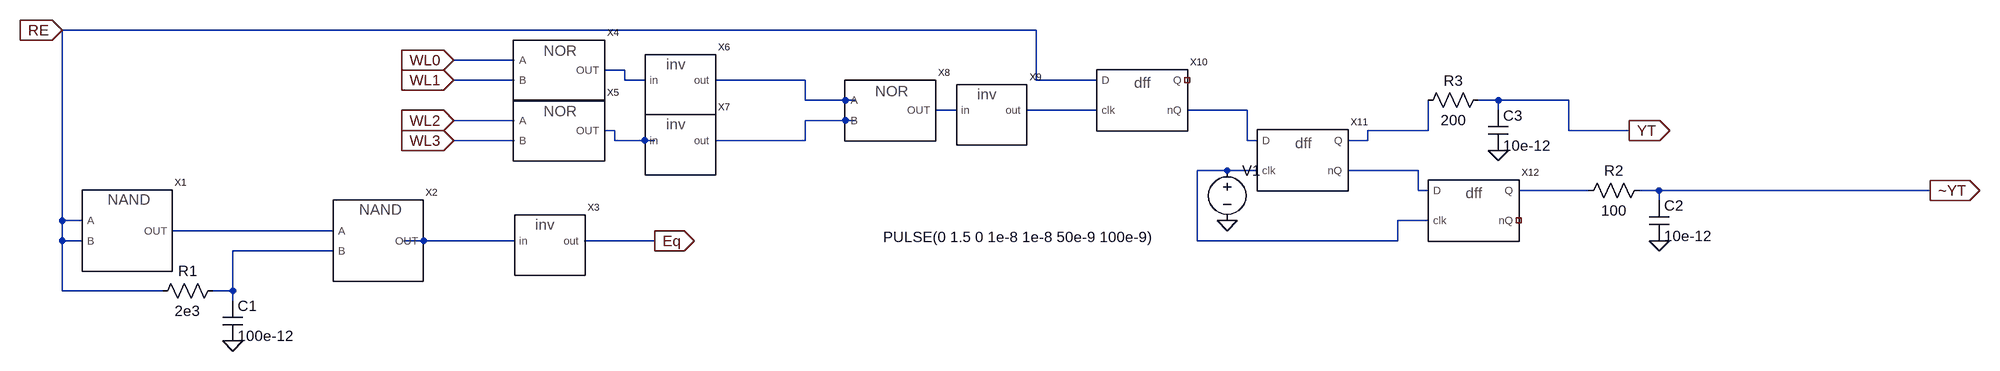
[diagram p0: schematic control_unit.asc]
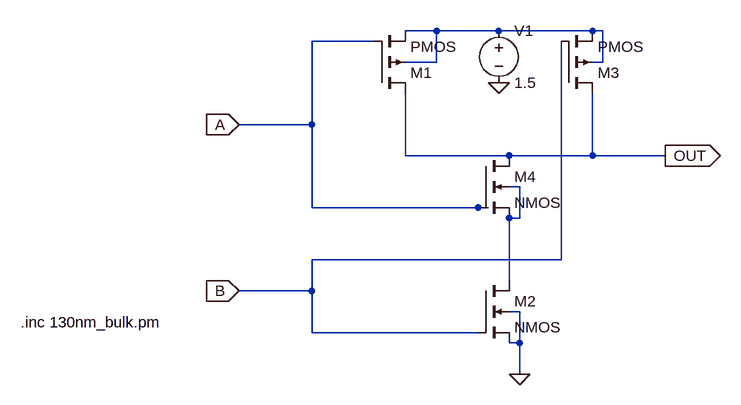
[diagram p1: sub-circuit nand.asc]
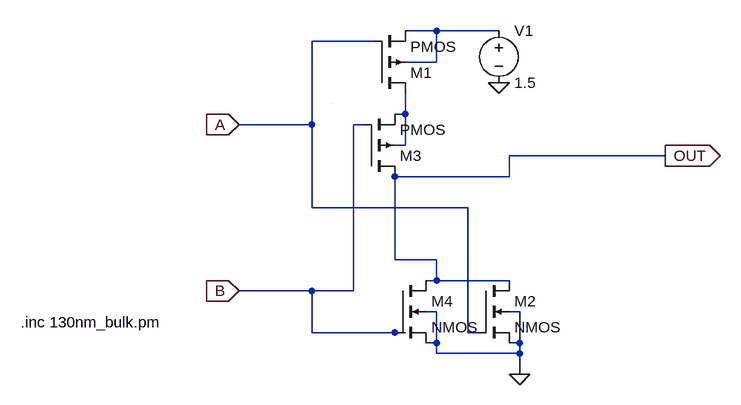
[diagram p2: sub-circuit nor.asc]
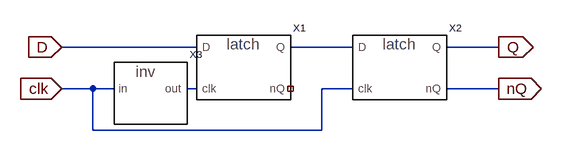
[diagram p3: sub-circuit dff.asc]
control_unit.asc, the LTspice schematic file:
Version 4
SHEET 1 2124 680
WIRE 592 -64 -960 -64
WIRE -240 -16 -336 -16
WIRE -64 0 -96 0
WIRE -240 16 -336 16
WIRE -64 16 -64 0
WIRE -32 16 -64 16
WIRE 224 16 80 16
WIRE 592 16 592 -64
WIRE 688 16 592 16
WIRE 224 48 224 16
WIRE 288 48 224 48
WIRE 304 48 288 48
WIRE 1328 48 1296 48
WIRE 1440 48 1328 48
WIRE 464 64 432 64
WIRE 688 64 576 64
WIRE 928 64 832 64
WIRE 1328 64 1328 48
WIRE -240 80 -336 80
WIRE 288 80 224 80
WIRE 304 80 288 80
WIRE -80 96 -96 96
WIRE 1216 96 1216 48
WIRE 1216 96 1120 96
WIRE 1440 96 1440 48
WIRE 1536 96 1440 96
WIRE -240 112 -336 112
WIRE -80 112 -80 96
WIRE -32 112 -80 112
WIRE -16 112 -32 112
WIRE 224 112 224 80
WIRE 224 112 80 112
WIRE 928 112 928 64
WIRE 944 112 928 112
WIRE 1120 112 1120 96
WIRE 1120 112 1088 112
WIRE 896 160 848 160
WIRE 944 160 896 160
WIRE 1200 160 1088 160
WIRE 1200 192 1200 160
WIRE 1216 192 1200 192
WIRE 1472 192 1360 192
WIRE 1584 192 1552 192
WIRE 2016 192 1584 192
WIRE 1584 208 1584 192
WIRE -960 240 -960 -64
WIRE -928 240 -960 240
WIRE 1216 240 1168 240
WIRE -528 256 -784 256
WIRE -960 272 -960 240
WIRE -928 272 -960 272
WIRE -384 272 -416 272
WIRE -240 272 -384 272
WIRE -16 272 -128 272
WIRE 848 272 848 160
WIRE 1168 272 1168 240
WIRE 1168 272 848 272
WIRE -528 288 -688 288
WIRE -960 352 -960 272
WIRE -800 352 -960 352
WIRE -688 352 -688 288
WIRE -688 352 -720 352
WIRE -688 368 -688 352
FLAG -688 432 0
FLAG -16 272 Eq
IOPIN -16 272 Out
FLAG -336 -16 WL0
IOPIN -336 -16 In
FLAG -336 16 WL1
IOPIN -336 16 In
FLAG -336 80 WL2
IOPIN -336 80 In
FLAG -336 112 WL3
IOPIN -336 112 In
FLAG 1536 96 YT
IOPIN 1536 96 Out
FLAG 896 240 0
FLAG 2016 192 ~YT
IOPIN 2016 192 Out
FLAG 1584 272 0
FLAG 1328 128 0
FLAG -960 -64 RE
IOPIN -960 -64 In
SYMBOL NAND -880 256 R0
SYMATTR InstName X1
SYMBOL NAND -480 272 R0
SYMATTR InstName X2
SYMBOL res -704 336 R90
WINDOW 0 0 56 VBottom 2
WINDOW 3 32 56 VTop 2
SYMATTR InstName R1
SYMATTR Value 2e3
SYMBOL cap -704 368 R0
SYMATTR InstName C1
SYMATTR Value 100e-12
SYMBOL invert -192 288 R0
SYMATTR InstName X3
SYMBOL NOR -176 -16 R0
SYMATTR InstName X4
SYMBOL NOR -176 80 R0
SYMATTR InstName X5
SYMBOL invert 16 32 R0
SYMATTR InstName X6
SYMBOL invert 16 128 R0
SYMATTR InstName X7
SYMBOL NOR 352 48 R0
SYMATTR InstName X8
SYMBOL invert 512 80 R0
SYMATTR InstName X9
SYMBOL DFF 768 48 R0
SYMATTR InstName X10
SYMBOL voltage 896 144 R0
WINDOW 3 -548 122 Left 2
WINDOW 123 0 0 Left 0
WINDOW 39 0 0 Left 0
SYMATTR Value PULSE(0 1.5 0 1e-8 1e-8 50e-9 100e-9)
SYMATTR InstName V1
SYMBOL dff 1024 144 R0
SYMATTR InstName X11
SYMBOL dff 1296 224 R0
SYMATTR InstName X12
SYMBOL res 1568 176 R90
WINDOW 0 0 56 VBottom 2
WINDOW 3 32 56 VTop 2
SYMATTR InstName R2
SYMATTR Value 100
SYMBOL cap 1568 208 R0
SYMATTR InstName C2
SYMATTR Value 10e-12
SYMBOL res 1312 32 R90
WINDOW 0 0 56 VBottom 2
WINDOW 3 32 56 VTop 2
SYMATTR InstName R3
SYMATTR Value 200
SYMBOL cap 1312 64 R0
SYMATTR InstName C3
SYMATTR Value 10e-12

nand.asc, the sub-circuit schematic file:
Version 4
SHEET 1 880 680
WIRE 304 -256 256 -256
WIRE 400 -256 304 -256
WIRE 544 -256 400 -256
WIRE 560 -256 544 -256
WIRE 208 -240 112 -240
WIRE 304 -208 304 -256
WIRE 304 -208 256 -208
WIRE 560 -208 560 -256
WIRE 560 -208 544 -208
WIRE 112 -112 112 -240
WIRE 112 -112 0 -112
WIRE 256 -64 256 -160
WIRE 416 -64 256 -64
WIRE 544 -64 544 -160
WIRE 544 -64 416 -64
WIRE 656 -64 544 -64
WIRE 432 -16 416 -16
WIRE 112 16 112 -112
WIRE 368 16 112 16
WIRE 384 16 368 16
WIRE 432 32 432 -16
WIRE 432 32 416 32
WIRE 496 96 496 -240
WIRE 496 96 112 96
WIRE 416 128 416 32
WIRE 112 144 112 96
WIRE 112 144 0 144
WIRE 432 176 416 176
WIRE 112 208 112 144
WIRE 368 208 112 208
WIRE 432 224 432 176
WIRE 432 224 416 224
WIRE 432 272 432 224
FLAG 432 272 0
FLAG 400 -176 0
FLAG 656 -64 OUT
IOPIN 656 -64 Out
FLAG 0 -112 A
IOPIN 0 -112 In
FLAG 0 144 B
IOPIN 0 144 In
SYMBOL pmos4 208 -160 M180
SYMATTR InstName M1
SYMATTR Value2 l=130e-9 w=2600e-9 ad=676000e-18 as=676000e-18 pd=3640e-9 ps=3640e-9
SYMBOL nmos4 368 128 R0
SYMATTR InstName M2
SYMATTR Value2 l=130e-9 w=1300e-9 ad=676000e-18 as=676000e-18 pd=3640e-9 ps=3640e-9
SYMBOL pmos4 496 -160 M180
SYMATTR InstName M3
SYMATTR Value2 l=130e-9 w=2600e-9 ad=676000e-18 as=676000e-18 pd=3640e-9 ps=3640e-9
SYMBOL nmos4 368 -64 R0
SYMATTR InstName M4
SYMATTR Value2 l=130e-9 w=1300e-9 ad=676000e-18 as=676000e-18 pd=3640e-9 ps=3640e-9
SYMBOL voltage 400 -272 R0
WINDOW 123 0 0 Left 0
WINDOW 39 0 0 Left 0
SYMATTR InstName V1
SYMATTR Value 1.5
TEXT -336 192 Left 2 !.inc 130nm_bulk.pm

nor.asc, the sub-circuit schematic file:
Version 4
SHEET 1 880 680
WIRE 160 -112 112 -112
WIRE 256 -112 160 -112
WIRE 64 -96 -32 -96
WIRE 160 -64 160 -112
WIRE 160 -64 112 -64
WIRE 112 16 112 -16
WIRE 112 16 96 16
WIRE -32 32 -32 -96
WIRE -32 32 -144 32
WIRE 48 32 32 32
WIRE 112 64 112 16
WIRE 112 64 96 64
WIRE 512 80 272 80
WIRE 272 112 272 80
WIRE 272 112 96 112
WIRE -32 160 -32 32
WIRE 208 160 -32 160
WIRE 96 240 96 112
WIRE 160 240 96 240
WIRE 160 272 160 240
WIRE 160 272 144 272
WIRE 272 272 160 272
WIRE -32 288 -144 288
WIRE 32 288 32 32
WIRE 32 288 -32 288
WIRE 160 320 144 320
WIRE 288 320 272 320
WIRE -32 352 -32 288
WIRE 96 352 -32 352
WIRE 112 352 96 352
WIRE 208 352 208 160
WIRE 224 352 208 352
WIRE 160 368 160 320
WIRE 160 368 144 368
WIRE 288 368 288 320
WIRE 288 368 272 368
WIRE 160 384 160 368
WIRE 288 384 288 368
WIRE 288 384 160 384
WIRE 288 416 288 384
WIRE 0 0 0 0
FLAG 288 416 0
FLAG 256 -32 0
FLAG 512 80 OUT
IOPIN 512 80 Out
FLAG -144 32 A
IOPIN -144 32 In
FLAG -144 288 B
IOPIN -144 288 In
SYMBOL pmos4 64 -16 M180
SYMATTR InstName M1
SYMATTR Value2 l=130e-9 w=2600e-9 ad=676000e-18 as=676000e-18 pd=3640e-9 ps=3640e-9
SYMBOL nmos4 224 272 R0
SYMATTR InstName M2
SYMATTR Value2 l=130e-9 w=1300e-9 ad=676000e-18 as=676000e-18 pd=3640e-9 ps=3640e-9
SYMBOL pmos4 48 112 M180
SYMATTR InstName M3
SYMATTR Value2 l=130e-9 w=2600e-9 ad=676000e-18 as=676000e-18 pd=3640e-9 ps=3640e-9
SYMBOL nmos4 96 272 R0
SYMATTR InstName M4
SYMATTR Value2 l=130e-9 w=1300e-9 ad=676000e-18 as=676000e-18 pd=3640e-9 ps=3640e-9
SYMBOL voltage 256 -128 R0
WINDOW 123 0 0 Left 0
WINDOW 39 0 0 Left 0
SYMATTR InstName V1
SYMATTR Value 1.5
TEXT -480 336 Left 2 !.inc 130nm_bulk.pm

dff.asc, the sub-circuit schematic file:
Version 4
SHEET 1 880 680
WIRE 64 112 -144 112
WIRE 304 112 208 112
WIRE 528 112 448 112
WIRE -96 176 -144 176
WIRE -64 176 -96 176
WIRE 64 176 48 176
WIRE 304 176 256 176
WIRE 528 176 448 176
WIRE -96 240 -96 176
WIRE 256 240 256 176
WIRE 256 240 -96 240
FLAG 528 112 Q
IOPIN 528 112 Out
FLAG -144 112 D
IOPIN -144 112 In
FLAG -144 176 clk
IOPIN -144 176 In
FLAG 528 176 nQ
IOPIN 528 176 Out
SYMBOL D_Latch 144 160 R0
SYMATTR InstName X1
SYMBOL D_Latch 384 160 R0
SYMATTR InstName X2
SYMBOL invert -16 192 R0
SYMATTR InstName X3

The netlist it stands for:
* control_unit.asc
XX1 RE RE N012 nand
XX2 N012 N014 N013 nand
R1 N014 RE 2e3
C1 N014 0 100e-12
XX3 N013 Eq invert  ; pins in out
XX4 WL0 WL1 N001 nor
XX5 WL2 WL3 N007 nor
XX6 N001 N002 invert  ; pins in out
XX7 N007 N006 invert  ; pins in out
XX8 N002 N006 N003 nor
XX9 N003 N004 invert  ; pins in out
XX10 RE N004 NC_01 N005 dff
V1 N009 0 PULSE(0 1.5 0 1e-8 1e-8 50e-9 100e-9)
XX11 N005 N009 N008 N010 dff
XX12 N010 N009 N011 NC_02 dff
R2 ~YT N011 100
C2 ~YT 0 10e-12
R3 YT N008 200
C3 YT 0 10e-12

* block symbol definitions
.subckt nand A B OUT
M1 OUT A N001 N001 PMOS l=130e-9 w=2600e-9 ad=676000e-18 as=676000e-18 pd=3640e-9 ps=3640e-9
M2 N002 B 0 0 NMOS l=130e-9 w=1300e-9 ad=676000e-18 as=676000e-18 pd=3640e-9 ps=3640e-9
M3 OUT B N001 N001 PMOS l=130e-9 w=2600e-9 ad=676000e-18 as=676000e-18 pd=3640e-9 ps=3640e-9
M4 OUT A N002 N002 NMOS l=130e-9 w=1300e-9 ad=676000e-18 as=676000e-18 pd=3640e-9 ps=3640e-9
V1 N001 0 1.5
.inc 130nm_bulk.pm
.ends nand

.subckt nor A B OUT
M1 N002 A N001 N001 PMOS l=130e-9 w=2600e-9 ad=676000e-18 as=676000e-18 pd=3640e-9 ps=3640e-9
M2 OUT A 0 0 NMOS l=130e-9 w=1300e-9 ad=676000e-18 as=676000e-18 pd=3640e-9 ps=3640e-9
M3 OUT B N002 N002 PMOS l=130e-9 w=2600e-9 ad=676000e-18 as=676000e-18 pd=3640e-9 ps=3640e-9
M4 OUT B 0 0 NMOS l=130e-9 w=1300e-9 ad=676000e-18 as=676000e-18 pd=3640e-9 ps=3640e-9
V1 N001 0 1.5
.inc 130nm_bulk.pm
.ends nor

.subckt dff D clk Q nQ
XX1 D N002 N001 NC_01 D_Latch  ; pins D clk Q nQ
XX2 N001 clk Q nQ D_Latch  ; pins D clk Q nQ
XX3 clk N002 invert  ; pins in out
.ends dff

.model NMOS NMOS
.model PMOS PMOS
.lib standard.mos
.backanno
.end